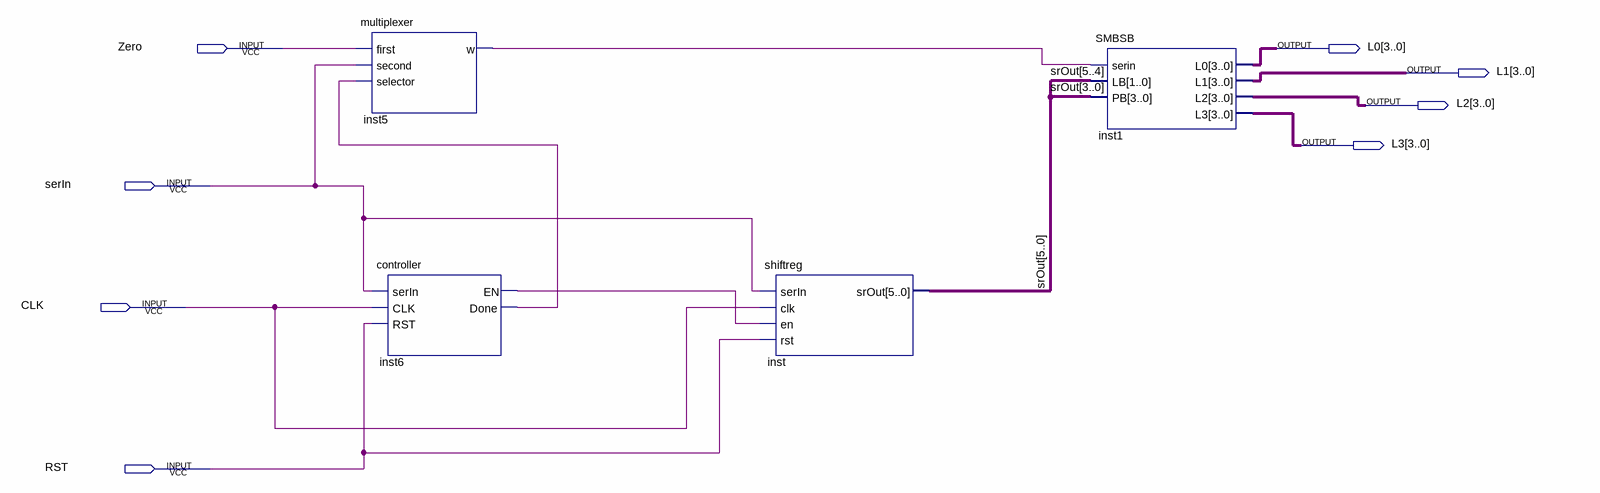
[diagram p0: schematic sheet]
// Quartus schematic CA5.bdf as structural Verilog: 4 symbols, 8 pins
module CA5 (
  input  Zero,
  input  serIn,
  input  CLK,
  input  RST,
  output [3:0] L0,
  output [3:0] L1,
  output [3:0] L2,
  output [3:0] L3
);

  wire inst5_w, inst6_done, inst6_en;
  wire [5:0] srOut;

  multiplexer inst5 (.first(Zero), .second(serIn), .selector(inst6_done), .w(inst5_w));
  controller inst6 (.serIn(serIn), .CLK(CLK), .RST(RST), .EN(inst6_en), .Done(inst6_done));
  shiftreg inst (.serIn(serIn), .clk(CLK), .en(inst6_en), .rst(RST), .srOut(srOut));
  SMBSB inst1 (.serin(inst5_w), .LB(srOut[5:4]), .PB(srOut[3:0]), .L0(L0), .L1(L1), .L2(L2), .L3(L3));
endmodule
